# EAGLE design SEC_PCB (EAGLE 9.6.2)
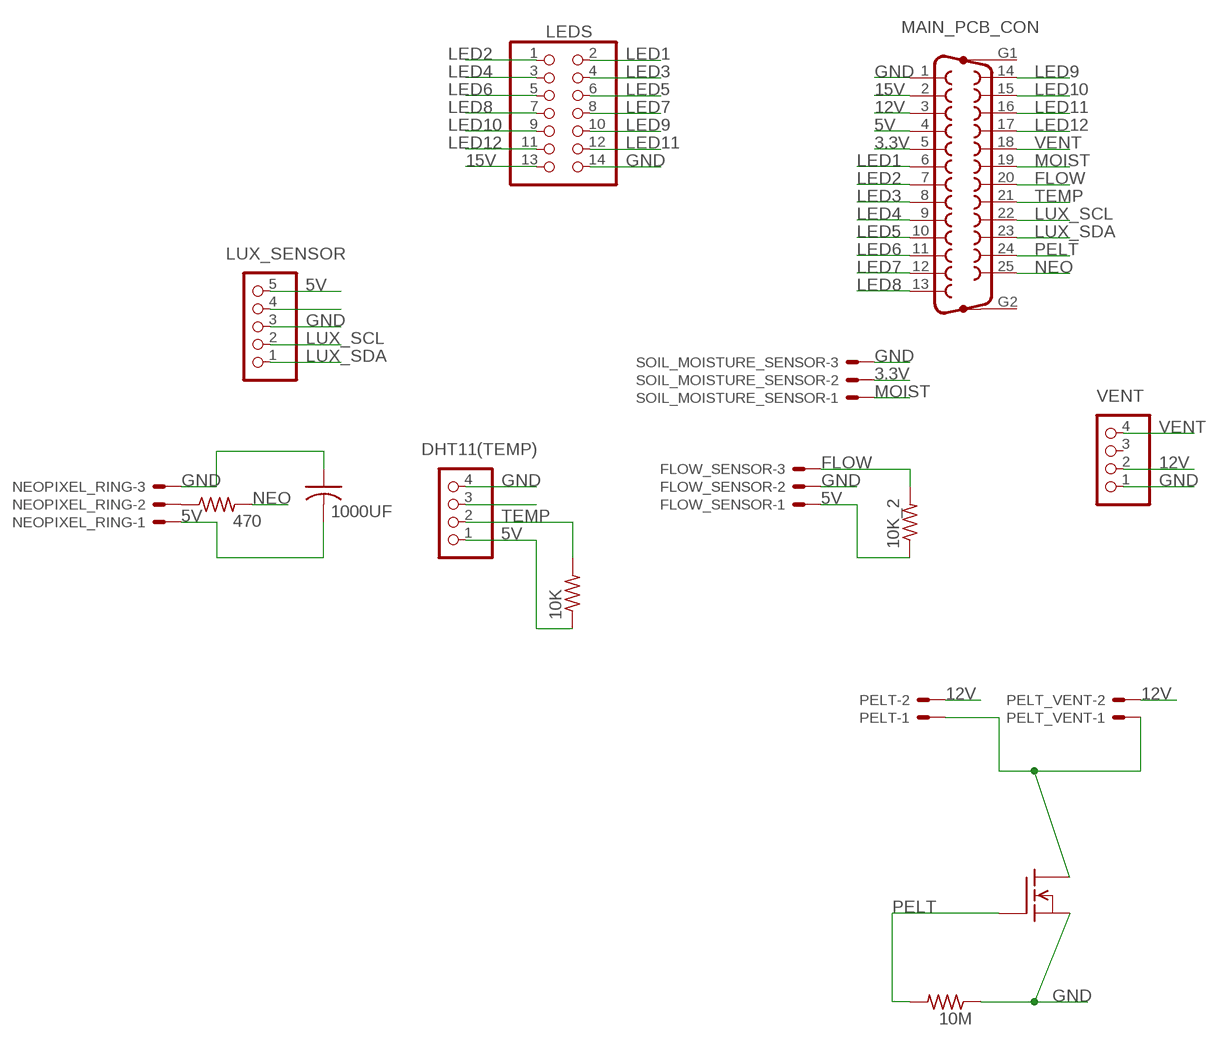
[diagram p0: schematic, sheet 1]

## Parts
10K  FLIPFLOP-RES  [0805-THM]
10K_2  FLIPFLOP-RES  [0805-THM]
10M  FLIPFLOP-RES  [0805-THM]
470  FLIPFLOP-RES  [0805-THM]
1000UF  C-US050-035X075  [C050-035X075]
DHT11(TEMP)  PINHD-1X4  [1X04]
FLOW_SENSOR  JST-XH-03-PIN-LONG-PAD  [JST-XH-03-PACKAGE-LONG-PAD]
LEDS  PINHD-2X7  [2X07]
LUX_SENSOR  PINHD-1X5  [1X05]
MAIN_PCB_CON  F25VP  [F25VP]
NEOPIXEL_RING  JST-XH-03-PIN-LONG-PAD  [JST-XH-03-PACKAGE-LONG-PAD]
PELT  JST-XH-02-PIN-LONG-PAD  [JST-XH-02-PACKAGE-LONG-PAD]
PELT_TRANSISTOR  FQN1N50C  [TO92]
PELT_VENT  JST-XH-02-PIN-LONG-PAD  [JST-XH-02-PACKAGE-LONG-PAD]
SOIL_MOISTURE_SENSOR  JST-XH-03-PIN-LONG-PAD  [JST-XH-03-PACKAGE-LONG-PAD]
VENT  PINHD-1X4  [1X04]

## Nets
3.3V: MAIN_PCB_CON.5 SOIL_MOISTURE_SENSOR.2
5V: 10K.1 10K_2.1 1000UF.2 DHT11(TEMP).1 FLOW_SENSOR.1 LUX_SENSOR.5 MAIN_PCB_CON.4 NEOPIXEL_RING.1
12V: MAIN_PCB_CON.3 PELT.2 PELT_VENT.2 VENT.2
15V: LEDS.13 MAIN_PCB_CON.2
FLOW: 10K_2.2 FLOW_SENSOR.3 MAIN_PCB_CON.20
GND: 10M.1 1000UF.1 DHT11(TEMP).4 FLOW_SENSOR.2 LEDS.14 LUX_SENSOR.3 MAIN_PCB_CON.1 NEOPIXEL_RING.3 PELT_TRANSISTOR.3(S) SOIL_MOISTURE_SENSOR.3 VENT.1
LED1: LEDS.2 MAIN_PCB_CON.6
LED2: LEDS.1 MAIN_PCB_CON.7
LED3: LEDS.4 MAIN_PCB_CON.8
LED4: LEDS.3 MAIN_PCB_CON.9
LED5: LEDS.6 MAIN_PCB_CON.10
LED6: LEDS.5 MAIN_PCB_CON.11
LED7: LEDS.8 MAIN_PCB_CON.12
LED8: LEDS.7 MAIN_PCB_CON.13
LED9: LEDS.10 MAIN_PCB_CON.14
LED10: LEDS.9 MAIN_PCB_CON.15
LED11: LEDS.12 MAIN_PCB_CON.16
LED12: LEDS.11 MAIN_PCB_CON.17
LUX_SCL: LUX_SENSOR.2 MAIN_PCB_CON.22
LUX_SDA: LUX_SENSOR.1 MAIN_PCB_CON.23
MOIST: MAIN_PCB_CON.19 SOIL_MOISTURE_SENSOR.1
N$1: 470.1 NEOPIXEL_RING.2
N$2: DHT11(TEMP).3
N$3: LUX_SENSOR.4
N$6: PELT.1 PELT_TRANSISTOR.2(D) PELT_VENT.1
NEO: 470.2 MAIN_PCB_CON.25
PELT: 10M.2 MAIN_PCB_CON.24 PELT_TRANSISTOR.1(G)
TEMP: 10K.2 DHT11(TEMP).2 MAIN_PCB_CON.21
VENT: MAIN_PCB_CON.18 VENT.4
Unconnected: MAIN_PCB_CON.G1 MAIN_PCB_CON.G2 VENT.3

## Library data of the parts
10K 10K_2 10M 470 = adafruit:FLIPFLOP-RES: Flip Flop resistor An 0805 resistor inside a standard 1/4W 5% resistor. Makes for easy mods
1000UF = adafruit:C-US: CAPACITOR, American symbol
DHT11(TEMP) VENT = pinhead:PINHD-1X4: PIN HEADER
FLOW_SENSOR NEOPIXEL_RING SOIL_MOISTURE_SENSOR = Rembrandt Electronics - JST XH Connectors v1-0:JST-XH-03-PIN: JST XH Connector 2 Pin Wire to board connector. Pitch: 2,54 mm, (0.100") Number of pins: 3 Created by Rembrandt Electronics www.rembrandtelectronics.com
LEDS = pinhead:PINHD-2X7: PIN HEADER
LUX_SENSOR = pinhead:PINHD-1X5: PIN HEADER
MAIN_PCB_CON = con-subd:F25VP: SUB-D; OC_FARNELL: unknown; OC_NEWARK: unknown
PELT PELT_VENT = Rembrandt Electronics - JST XH Connectors v1-0:JST-XH-02-PIN: JST XH Connector 2 Pin Wire to board connector. Pitch: 2,54 mm, (0.100") Number of pins: 2 Created by Rembrandt Electronics www.rembrandtelectronics.com
PELT_TRANSISTOR = adafruit:FQN1N50C: N-Channel Enhancement MOSFET 500V, 0.4A, 6.0 Ohm

## Board
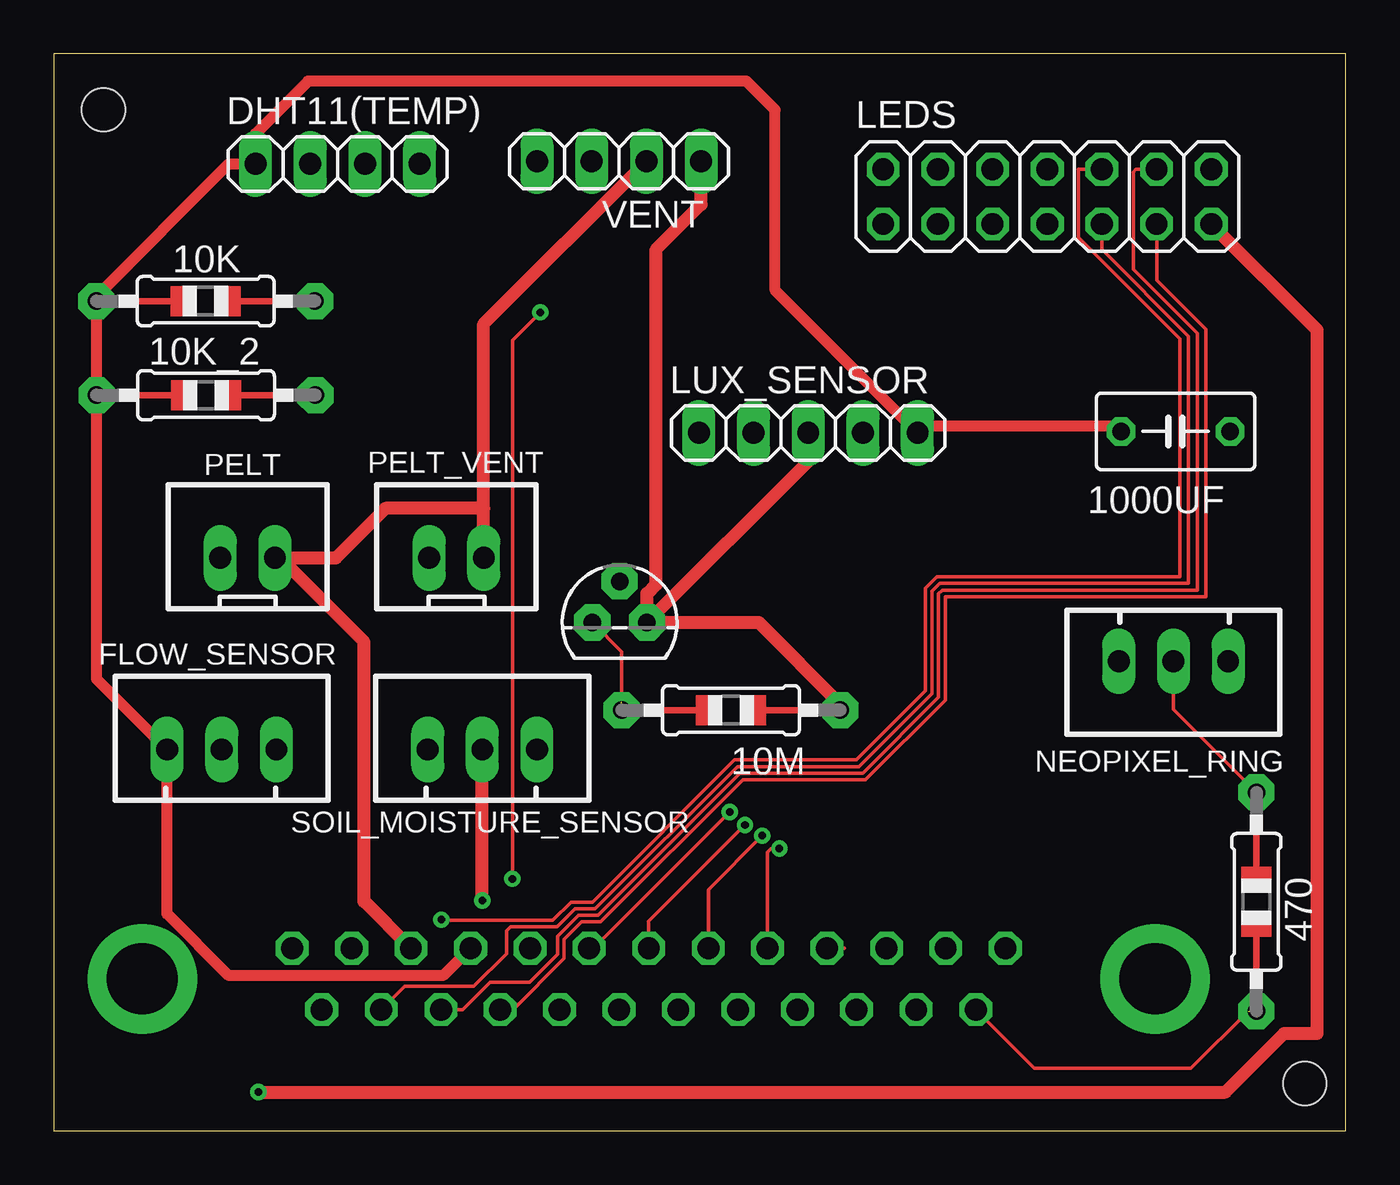
[diagram p1: board, top side]
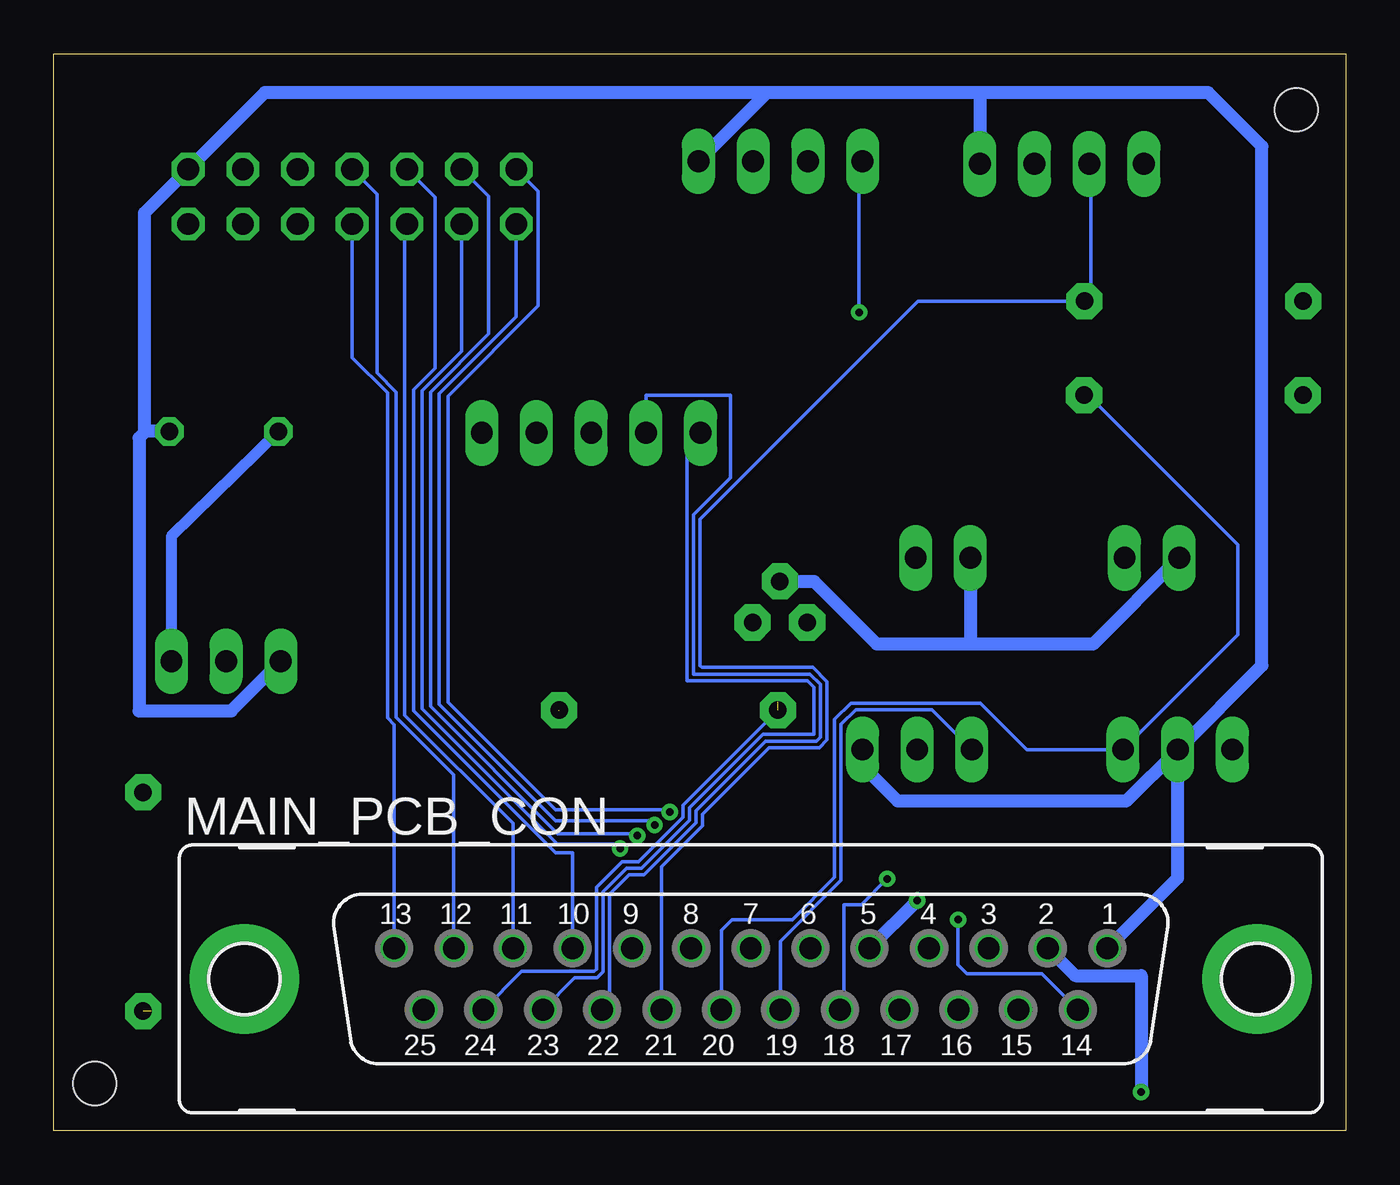
[diagram p2: board, bottom side, seen from below]

Size 60 x 50 mm. Coordinates in mm from the lower left corner, seen from the top.
Outline: 0,0 60,0 60,50 0,50 0,0
Copper layers (1*16): Top 0.035mm / dielectric 1.5mm / Bottom 0.035mm
Design rules "default": minimum track width 6mil, minimum drill 0.35mm, track to track 6mil, track to pad 6mil, pad to pad 6mil, via to via 6mil, smd to smd 6mil, copper to edge 40mil, drill to drill 6mil, minimum pad ring 10mil, minimum via ring 8mil, stop-mask expansion 4mil, vias tented up to drill 0mil, thermal gap 10mil
Holes 2 mm at 58.1,2.2 2.3,47.4

### Footprints (pad centres in the part's own frame; a part is rotated, then mirrored left to right if it is on the bottom)
0805-THM = drill 0.813 pad 1.676 octagon: 1 -5.08,0; 2 5.08,0
C050-035X075 = drill 0.813 octagon: 1 -2.54,0; 2 2.54,0
1X04 = drill 1.016 long: 1 -3.81,0; 2 -1.27,0; 3 1.27,0; 4 3.81,0
JST-XH-03-PACKAGE-LONG-PAD = drill 1.016 long: 1 -2.54,0; 2 0,0; 3 2.54,0
2X07 = drill 1.016 octagon: 1 -7.62,-1.27; 2 -7.62,1.27; 3 -5.08,-1.27; 4 -5.08,1.27; 5 -2.54,-1.27; 6 -2.54,1.27; 7 0,-1.27; 8 0,1.27; 9 2.54,-1.27; 10 2.54,1.27; 11 5.08,-1.27; 12 5.08,1.27; 13 7.62,-1.27; 14 7.62,1.27
1X05 = drill 1.016 long: 1 -5.08,0; 2 -2.54,0; 3 0,0; 4 2.54,0; 5 5.08,0
F25VP = drill 1.016 octagon: 1 16.561,1.422; 2 13.792,1.422; 3 11.049,1.422; 4 8.28,1.422; 5 5.512,1.422; 6 2.769,1.422; 7 0,1.422; 8 -2.769,1.422; 9 -5.512,1.422; 10 -8.28,1.422; 11 -11.049,1.422; 12 -13.792,1.422; 13 -16.561,1.422; 14 15.189,-1.422; 15 12.421,-1.422; 16 9.652,-1.422; 17 6.909,-1.422; 18 4.14,-1.422; 19 1.372,-1.422; 20 -1.372,-1.422; 21 -4.14,-1.422; 22 -6.909,-1.422; 23 -9.652,-1.422; 24 -12.421,-1.422; 25 -15.189,-1.422 | drill 3.302 pad 5.08: G1 -23.52,0; G2 23.52,0
JST-XH-02-PACKAGE-LONG-PAD = drill 1.016 long: 1 -1.27,0; 2 1.27,0
TO92 = drill 0.813 pad 1.676 octagon: 1 -1.27,0; 2 0,1.905; 3 1.27,0

### Placement (x,y rotation side)
10K  7.05,38.52 0 top
10K_2  7.07,34.15 0 top
10M  31.45,19.53 180 top
470  55.85,10.63 270 top
1000UF  52.1,32.47 180 top
DHT11(TEMP)  13.18,44.89 0 top
FLOW_SENSOR  7.8,17.7 0 top
LEDS  46.14,43.37 0 top
LUX_SENSOR  35.04,32.4 0 top
MAIN_PCB_CON  27.63,7.05 0 bottom
NEOPIXEL_RING  52,21.8 180 top
PELT  9,26.6 0 top
PELT_TRANSISTOR  26.28,23.6 0 top
PELT_VENT  18.7,26.6 0 top
SOIL_MOISTURE_SENSOR  19.9,17.7 0 top
VENT  26.25,45.01 180 top

### Tracks (layer width: path | path; a pad name or v marks a point on that pad's centre or on a via)
3.3V  (via drill 0.35)
  Top 0.61: v19.9,10.69 SOIL_MOISTURE_SENSOR.2
  Bottom 0.61: MAIN_PCB_CON.5 v19.9,10.69
5V
  Top 0.508: MAIN_PCB_CON.4 18.08,7.2 8.13,7.2 5.26,10.07 FLOW_SENSOR.1 1.99,20.97 10K_2.1 1.99,38.5 10K.1 1.99,38.54 1.99,38.75 8.13,44.89 DHT11(TEMP).1 9.37,46.3 11.8,48.73 32.17,48.73 33.5,47.4 33.5,39.02 LUX_SENSOR.5 40.42,32.7 49.51,32.7 49.51,32.52 1000UF.2
  Bottom 0.508: NEOPIXEL_RING.1 54.54,27.6 1000UF.2
12V
  Top 0.61: MAIN_PCB_CON.3 14.4,10.65 14.4,22.7 10.5,26.6 PELT.2 13.1,26.6 15.4,28.9 19.97,28.9 PELT_VENT.2 19.97,37.46 VENT.2
15V  (via drill 0.35)
  Top 0.61: v9.5,1.8 54.42,1.8 57.14,4.52 58.68,4.52 58.68,37.18 LEDS.13
  Bottom 0.61: MAIN_PCB_CON.2 12.56,7.2 9.5,7.2 v9.5,1.8
  Bottom 0.813: 13.94,8.47 MAIN_PCB_CON.2
FLOW
  Bottom 0.152: MAIN_PCB_CON.20 29,9.3 28.5,9.8 25.7,9.8 23.73,11.77 23.73,19.1 22.98,19.86 16.95,19.86 14.8,17.7 FLOW_SENSOR.3 5,23.04 5,27.2 11.95,34.15 10K_2.2
GND  (1 unrouted)
  Top 0.61: LUX_SENSOR.3 35.04,31.09 PELT_TRANSISTOR.3 | 36.56,19.53 36.56,19.78 32.74,23.6 PELT_TRANSISTOR.3 | PELT_TRANSISTOR.3 27.55,24.94 27.98,25.37 27.98,40.92 30.06,43.01 VENT.1
  Bottom 0.61: MAIN_PCB_CON.1 7.8,11.74 FLOW_SENSOR.2 | FLOW_SENSOR.2 10.2,15.3 20.8,15.3 22.44,16.94 SOIL_MOISTURE_SENSOR.3 | FLOW_SENSOR.2 3.89,21.61 3.89,45.71 6.38,48.2 17,48.2 | 17,48.2 DHT11(TEMP).4 | 17,48.2 26.87,48.2 | VENT.1 26.87,48.2 | 26.87,48.2 50.2,48.2 LEDS.14 55.8,42.6 55.8,32.47 1000UF.1 55.74,32.47 56.04,32.17 56.04,19.5 51.76,19.5 NEOPIXEL_RING.3
LED1  (via drill 0.35)
  Top 0.152: v31.39,14.8 25.06,8.47 MAIN_PCB_CON.6
  Bottom 0.152: v31.39,14.8 31.49,14.9 36.7,14.9 41.7,19.9 41.7,34.1 37.5,38.3 37.5,43.62 LEDS.2
LED2  (via drill 0.35)
  Top 0.152: MAIN_PCB_CON.7 27.63,9.73 v32.1,14.2
  Bottom 0.152: v32.1,14.2 32.3,14.4 36.7,14.4 42.1,19.8 42.1,34.22 38.52,37.8 LEDS.1
LED3  (via drill 0.35)
  Top 0.152: MAIN_PCB_CON.8 30.4,11.2 v32.9,13.7
  Bottom 0.152: v32.9,13.7 33,13.8 36.6,13.8 42.5,19.7 42.5,34.3 39.8,37 39.8,43.38 LEDS.4
LED4  (via drill 0.35)
  Top 0.152: MAIN_PCB_CON.9 33.14,12.94 33.3,13.1 v33.7,13.1
  Bottom 0.152: v33.7,13.1 33.9,13.3 36.6,13.3 42.9,19.6 42.9,34.36 41.06,36.2 LEDS.3
LED5
  Top 0.152: MAIN_PCB_CON.10 36.71,8.47
  Bottom 0.152: MAIN_PCB_CON.10 35.9,8.48 35.9,12.9 36.7,12.9 43.3,19.5 43.3,34.4 42.3,35.4 42.3,43.34 LEDS.6
LED6
  Bottom 0.152: MAIN_PCB_CON.11 38.68,14.28 43.7,19.3 43.7,42 LEDS.5
LED7
  Bottom 0.152: MAIN_PCB_CON.12 41.42,16.52 44.1,19.2 44.1,34.3 44.99,35.19 44.99,43.49 LEDS.8
LED8
  Bottom 0.152: MAIN_PCB_CON.13 44.19,18.86 44.49,19.16 44.49,34.26 46.14,35.9 LEDS.7
LED9  (via drill 0.35)
  Top 0.152: v18,9.8 18.03,9.77 23.17,9.77 24.01,10.61 25.02,10.61 31.62,17.21 37.27,17.21 40.49,20.43 40.49,25.18 41.02,25.71 52.3,25.71 52.3,36.77 47.59,41.48 47.59,44.64 LEDS.10
  Bottom 0.152: MAIN_PCB_CON.14 14.11,7.3 17.6,7.3 18,7.7 v18,9.8
LED10
  Top 0.152: MAIN_PCB_CON.15 16.28,6.7 19.5,6.7 21.03,8.23 21.03,9.28 21.21,9.46 23.36,9.46 24.21,10.31 25.15,10.31 31.75,16.91 37.4,16.91 40.79,20.3 40.79,25.05 41.15,25.41 52.7,25.41 52.7,36.9 48.68,40.92 LEDS.9
LED11
  Top 0.152: MAIN_PCB_CON.16 18.98,5.63 20.25,6.9 22.1,6.9 23.39,8.2 23.39,9.03 24.37,10.01 25.27,10.01 31.87,16.61 37.57,16.61 41.09,20.13 41.09,24.93 41.27,25.11 53.1,25.11 53.1,37.04 50.13,40.01 50.13,44.51 50.26,44.64 LEDS.12
LED12
  Top 0.152: MAIN_PCB_CON.17 21.32,5.63 23.7,8.01 23.7,8.9 24.5,9.7 25.4,9.7 32,16.3 37.7,16.3 41.4,20 41.4,24.8 53.5,24.8 53.5,37.22 51.22,39.5 LEDS.11
LUX_SCL
  Bottom 0.152: MAIN_PCB_CON.22 34.19,5.98 34.19,10.97 33.28,11.88 32.59,11.88 30.17,14.3 30.17,14.87 26.94,18.09 24.57,18.09 24.39,18.27 24.39,20.73 24.87,21.2 30.3,21.2 30.3,28.6 28.57,30.33 28.57,34.15 32.5,34.15 LUX_SENSOR.2
LUX_SDA
  Bottom 0.152: MAIN_PCB_CON.23 35.81,7.09 34.77,7.09 34.49,7.37 34.49,11.1 33.41,12.19 32.71,12.19 30.48,14.42 30.48,14.99 27.07,18.4 24.7,18.4 24.7,20.6 25,20.9 30.6,20.9 30.6,31.76 LUX_SENSOR.1
MOIST
  Bottom 0.152: MAIN_PCB_CON.19 26.26,8.8 23.43,11.63 23.43,18.87 22.75,19.55 19.21,19.55 SOIL_MOISTURE_SENSOR.1
N$1
  Top 0.152: NEOPIXEL_RING.2 52,19.56 470.1
N$6
  Bottom 0.61: PELT.1 11.73,22.6 17.6,22.6 | PELT_TRANSISTOR.2 26.27,25.5 24.67,25.5 21.78,22.6 17.6,22.6 | PELT_VENT.1 17.43,22.77 17.6,22.6
NEO  (1 unrouted)
  Top 0.152: MAIN_PCB_CON.25 45.55,2.9 52.82,2.9 55.47,5.55
PELT  (1 unrouted)
  Top 0.152: PELT_TRANSISTOR.1 26.37,22.24 26.37,19.91
  Bottom 0.152: MAIN_PCB_CON.24 38.28,7.4 34.9,7.4 34.8,7.5 34.8,11.3 33.61,12.49 32.84,12.49 30.78,14.55 30.78,15.12 10M.2
TEMP
  Bottom 0.152: MAIN_PCB_CON.21 31.77,12.27 29.87,14.17 29.87,14.7 26.78,17.79 24.45,17.79 24.09,18.15 24.09,20.85 24.75,21.51 29.9,21.51 29.99,21.6 29.99,28.4 19.87,38.52 10K.2 11.83,38.82 11.83,44.81 DHT11(TEMP).2
  Bottom 0.406: DHT11(TEMP).2 11.91,43.59
VENT  (via drill 0.35)
  Top 0.152: v21.3,11.7 21.3,36.7 v22.6,38
  Bottom 0.152: MAIN_PCB_CON.18 23.3,5.82 23.3,10.5 22.5,10.5 v21.3,11.7 | v22.6,38 22.6,44.85 VENT.4